# EasyEDA Pro project ProProject_oven_danger_2024-05-19.epro

# Schematic Schematic1
Create Date: 2024-05-19; Page Name: P1; Project Name: oven_danger; Schematic Name: Schematic1; Update Date: 2024-05-19; Company: EasyEDA.com; Drawn: EasyEDA; Page Size: A4; Part Number: JLCPCB-002; Reviewed: EasyEDA; Version: V0.1
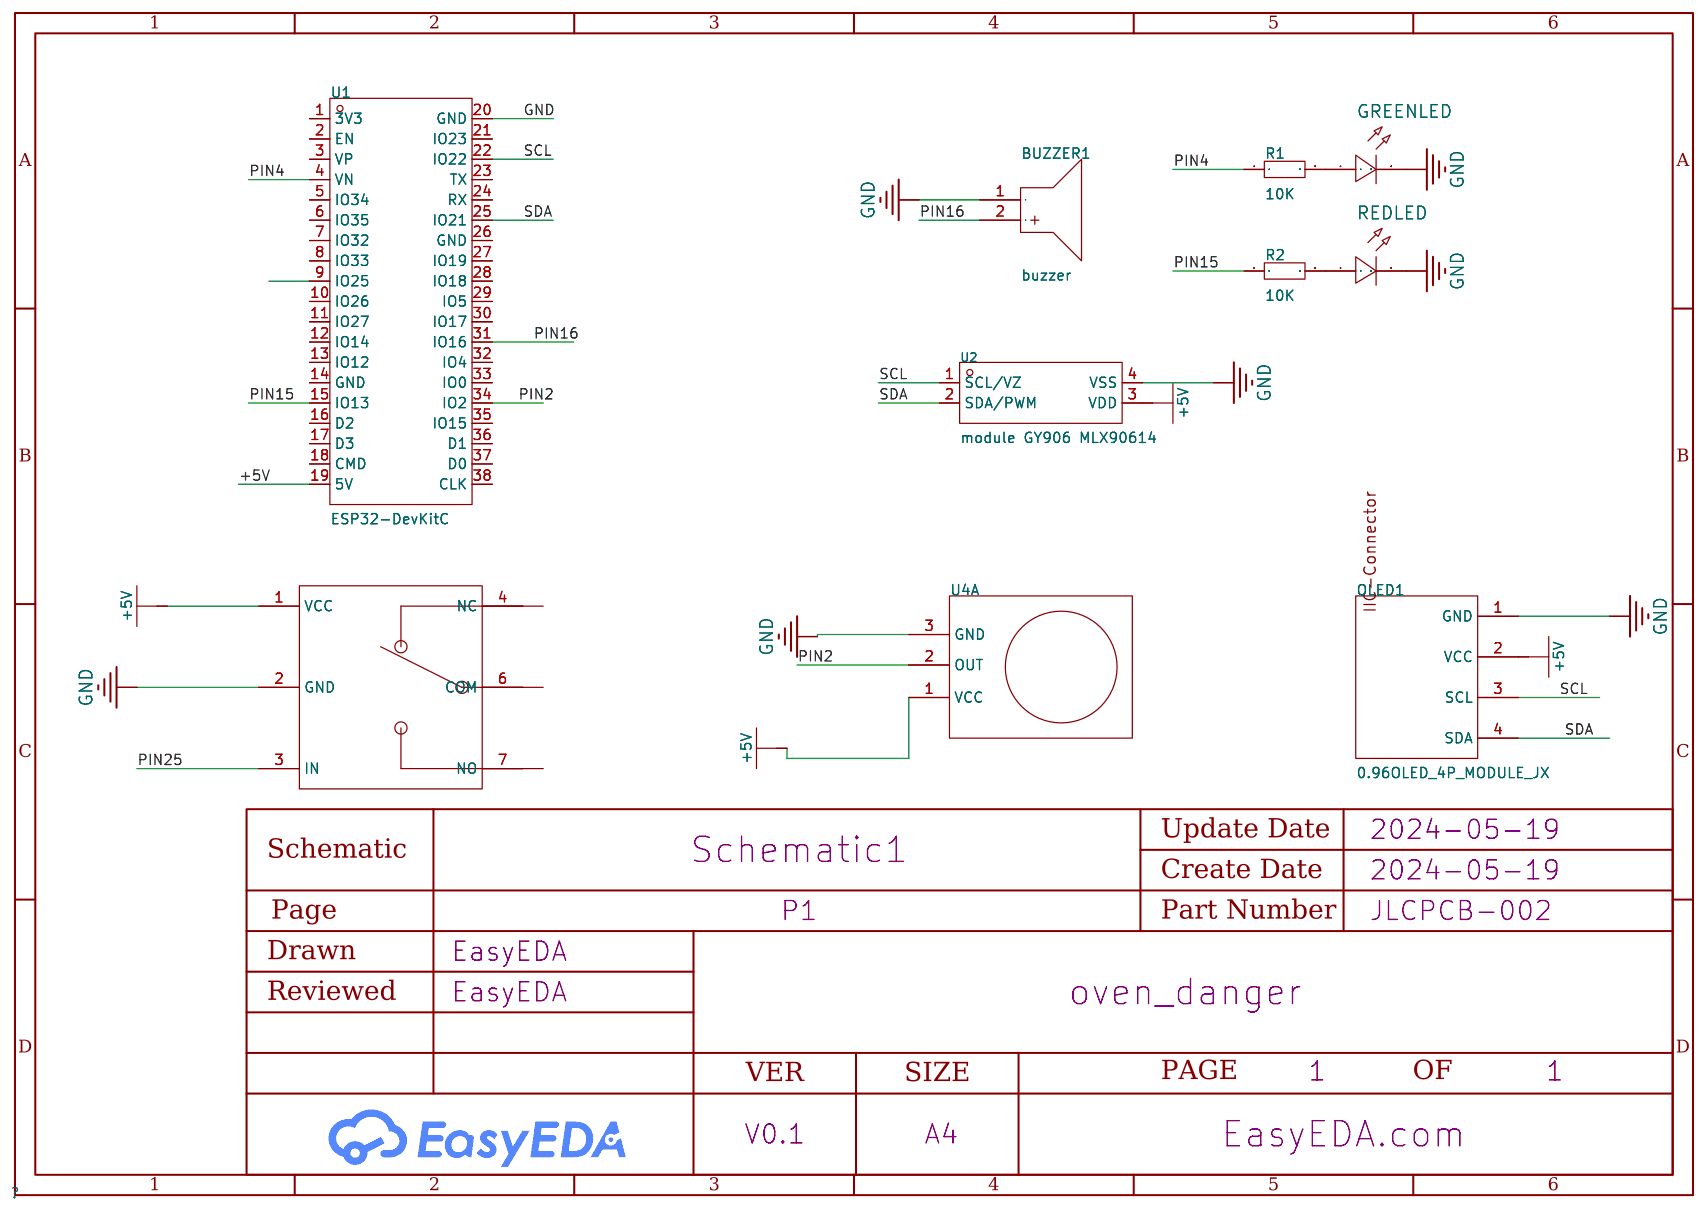
[diagram p0: schematic sheet]

## Parts
?#1  -
BUZZER1  buzzer  [BUZ-TH_BD12.0-P6.00-D0.9-RD]
GREENLED  -  [LED0402-RD_YELLOW]
OLED1  0.96OLED_4P_MODULE_JX  [0.96OLED_4P]
R1  10K  [R0201]
R2  10K  [R0201]
REDLED  -  [LED0402-RD_YELLOW]
U1  ESP32-DevKitC  [BULETM-SMD_ESP32-DEVKITC]
U2  module GY906 MLX90614  [TO-39-4_MELEXIS_MLX90614XXA]
U4  -  (section 1)

## Library data of the parts
?#1 = Relay-CAMM-v2
BUZZER1 = buzzer: Supplier Part: C9900014030; Supplier: LCSC
GREENLED REDLED = LED_0402-R: Supplier Footprint: 0402
OLED1 = 0.96OLED_4P_MODULE_JX: Supplier Part: C9900004566; Supplier Footprint: 插件; Supplier: LCSC
R1 R2 = Res_0201: Supplier Footprint: 0201
U1 = ESP32-DevKitC: CPU:- ROM Size:- Number of I/O: USB:- WIFI Protocols:- Bluetooth:- Ethernet:- Audio & Video Interface:- Multimedia Support:- Card Type:- Power Supply Type:- Power Supply:- POE Support:- Resolution:- Temperature Range:-; LCSC Part Name: 开发板; Supplier Part: C571180; Manufacturer: ESPRESSIF(乐鑫); JLCPCB Part Class: Extended Part; Datasheet: https://atta.szlcsc.com/upload/public/pdf/source/20200521/C529586_D6FCDAFCFF160B3EDDF7DF28D600699D.pdf; Supplier: LCSC
U2 = MLX90614ESF-BBA-000-TU: Resolution:- Resolution:- Supply Voltage:2.6V~3.6V Supply Voltage:2.6V~3.6V; Supplier Part: C17685247; Manufacturer: Melexis(比利时迈来芯); Supplier Footprint: TO-39; Datasheet: https://atta.szlcsc.com/upload/public/pdf/source/231023/C17192539-0c521c61c9b67c34f193697436f9a827.pdf; Supplier: LCSC; Supply Voltage: 2.6V~3.6V
U4 = HC-SR501

## Nets
+5V: ?#1.1(VCC) OLED1.2(VCC) U1.19(5V) U2.3(VDD) U4.1(VCC)
GND: ?#1.2(GND) BUZZER1.1(-) GREENLED.2(C) OLED1.1(GND) REDLED.2(C) U1.20(GND) U2.4(VSS) U4.3(GND)
PIN2: U1.34(IO2) U4.2(OUT)
PIN4: R1.1 U1.4(VN)
PIN15: R2.1 U1.15(IO13)
PIN16: BUZZER1.2(+) U1.31(IO16)
PIN25: ?#1.3(IN)
SCL: OLED1.3(SCL) U1.22(IO22) U2.1(SCL/VZ)
SDA: OLED1.4(SDA) U1.25(IO21) U2.2(SDA/PWM)
Net-(GREENLED-1): GREENLED.1(A) R1.2
Net-(R2-2): R2.2 REDLED.1(A)

Not connected (* = marked no-connect by the designer): ?#1 4(NC) 6(COM) 7(NO); U1 1(3V3) 2(EN) 3(VP) 5(IO34) 6(IO35) 7(IO32) 8(IO33) 9(IO25) 10(IO26) 11(IO27) 12(IO14) 13(IO12) 14(GND) 16(D2) 17(D3) 18(CMD) 21(IO23) 23(TX) 24(RX) 26(GND) 27(IO19) 28(IO18) 29(IO5) 30(IO17) 32(IO4) 33(IO0) 35(IO15) 36(D1) 37(D0) 38(CLK)
